# Altium project Boitier_Commande.PrjPcb
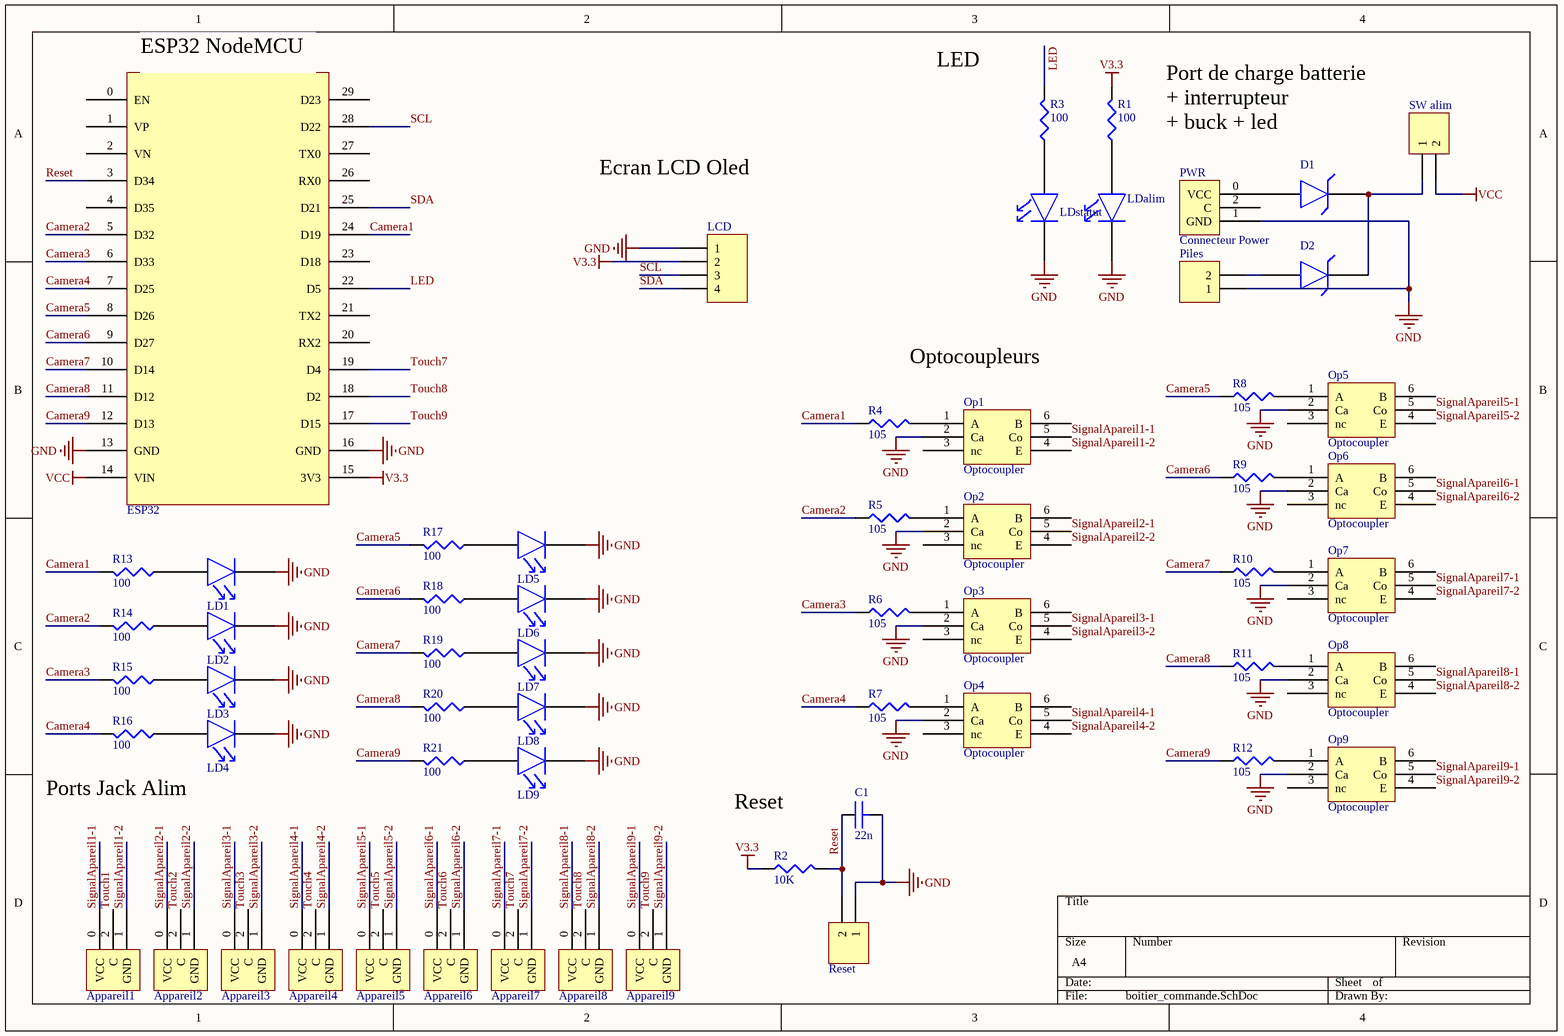
[diagram p0: boitier_commande.SchDoc]
1 sheet, 59 parts. Net scope: global (net labels, ports and power ports of the same name join across sheets).
Board file: boitier_commande.PcbDoc

## Sheet boitier_commande.SchDoc
size A4

### Parts
Appareil1  Connecteur Power  [Connecteur Power]  (value not drawn)
Appareil2  Connecteur Power  [Connecteur Power]  (value not drawn)
Appareil3  Connecteur Power  [Connecteur Power]  (value not drawn)
Appareil4  Connecteur Power  [Connecteur Power]  (value not drawn)
Appareil5  Connecteur Power  [Connecteur Power]  (value not drawn)
Appareil6  Connecteur Power  [Connecteur Power]  (value not drawn)
Appareil7  Connecteur Power  [Connecteur Power]  (value not drawn)
Appareil8  Connecteur Power  [Connecteur Power]  (value not drawn)
Appareil9  Connecteur Power  [Connecteur Power]  (value not drawn)
C1  value 22n  [RAD0.1]  (hidden comment: CAP)
D1  comment  [DIODE0.4]  (value not drawn)
D2  comment  [DIODE0.4]  (value not drawn)
ESP32  ESP32devKit  [ESP32]  (value not drawn)
LCD  OLED LCD  [HDR1X4]  (value not drawn)
LD1  comment  [LED0805]  (value not drawn)
LD2  comment  [LED0805]  (value not drawn)
LD3  comment  [LED0805]  (value not drawn)
LD4  comment  [LED0805]  (value not drawn)
LD5  comment  [LED0805]  (value not drawn)
LD6  comment  [LED0805]  (value not drawn)
LD7  comment  [LED0805]  (value not drawn)
LD8  comment  [LED0805]  (value not drawn)
LD9  comment  [LED0805]  (value not drawn)
LDalim  comment  [LED3]  (value not drawn)
LDstatut  comment  [LED3]  (value not drawn)
Op1  Optocoupler  [4N26]
Op2  Optocoupler  [4N26]
Op3  Optocoupler  [4N26]
Op4  Optocoupler  [4N26]
Op5  Optocoupler  [4N26]
Op6  Optocoupler  [4N26]
Op7  Optocoupler  [4N26]
Op8  Optocoupler  [4N26]
Op9  Optocoupler  [4N26]
Piles  Header 2  [HDR1X2]  (value not drawn)
PWR  Connecteur Power  [Connecteur Power]
R1  value 100  [AXIAL0.4]  (hidden comment: RES)
R2  value 10K  [AXIAL0.4]  (hidden comment: RES)
R3  value 100  [AXIAL0.4]  (hidden comment: RES)
R4  value 105  [AXIAL0.4]  (hidden comment: RES)
R5  value 105  [AXIAL0.4]  (hidden comment: RES)
R6  value 105  [AXIAL0.4]  (hidden comment: RES)
R7  value 105  [AXIAL0.4]  (hidden comment: RES)
R8  value 105  [AXIAL0.4]  (hidden comment: RES)
R9  value 105  [AXIAL0.4]  (hidden comment: RES)
R10  value 105  [AXIAL0.4]  (hidden comment: RES)
R11  value 105  [AXIAL0.4]  (hidden comment: RES)
R12  value 105  [AXIAL0.4]  (hidden comment: RES)
R13  value 100  [0805]  (hidden comment: RES)
R14  value 100  [0805]  (hidden comment: RES)
R15  value 100  [0805]  (hidden comment: RES)
R16  value 100  [0805]  (hidden comment: RES)
R17  value 100  [0805]  (hidden comment: RES)
R18  value 100  [0805]  (hidden comment: RES)
R19  value 100  [0805]  (hidden comment: RES)
R20  value 100  [0805]  (hidden comment: RES)
R21  value 100  [0805]  (hidden comment: RES)
Reset  Header 2  [HDR1X2]  (value not drawn)
SW_alim  Header 2  [HDR1X2]  (value not drawn)

### Nets
GND: C1.2 ESP32.13(GND) ESP32.16(GND) LCD.1 LD1.K LD2.K LD3.K LD4.K LD5.K LD6.K LD7.K LD8.K LD9.K LDalim.K LDstatut.K Op1.2(Ca) Op2.2(Ca) Op3.2(Ca) Op4.2(Ca) Op5.2(Ca) Op6.2(Ca) Op7.2(Ca) Op8.2(Ca) Op9.2(Ca) Piles.1 PWR.1(GND) Reset.1
V3.3: ESP32.15(3V3) LCD.2 R1.2 R2.1
VCC: ESP32.14(VIN) SW_alim.2
Camera1: ESP32.24(D19) R4.1 R13.2
Camera2: ESP32.5(D32) R5.1 R14.2
Camera3: ESP32.6(D33) R6.1 R15.2
Camera4: ESP32.7(D25) R7.1 R16.2
Camera5: ESP32.8(D26) R8.1 R17.2
Camera6: ESP32.9(D27) R9.1 R18.2
Camera7: ESP32.10(D14) R10.1 R19.2
Camera8: ESP32.11(D12) R11.1 R20.2
Camera9: ESP32.12(D13) R12.1 R21.2
LED: ESP32.22(D5) R3.2
Reset: C1.1 ESP32.3(D34) R2.2 Reset.2
SCL: ESP32.28(D22) LCD.3
SDA: ESP32.25(D21) LCD.4
SignalApareil1-1: Appareil1.0(VCC) Op1.5(Co)
SignalApareil1-2: Appareil1.1(GND) Op1.4(E)
SignalApareil2-1: Appareil2.0(VCC) Op2.5(Co)
SignalApareil2-2: Appareil2.1(GND) Op2.4(E)
SignalApareil3-1: Appareil3.0(VCC) Op3.5(Co)
SignalApareil3-2: Appareil3.1(GND) Op3.4(E)
SignalApareil4-1: Appareil4.0(VCC) Op4.5(Co)
SignalApareil4-2: Appareil4.1(GND) Op4.4(E)
SignalApareil5-1: Appareil5.0(VCC) Op5.5(Co)
SignalApareil5-2: Appareil5.1(GND) Op5.4(E)
SignalApareil6-1: Appareil6.0(VCC) Op6.5(Co)
SignalApareil6-2: Appareil6.1(GND) Op6.4(E)
SignalApareil7-1: Appareil7.0(VCC) Op7.5(Co)
SignalApareil7-2: Appareil7.1(GND) Op7.4(E)
SignalApareil8-1: Appareil8.0(VCC) Op8.5(Co)
SignalApareil8-2: Appareil8.1(GND) Op8.4(E)
SignalApareil9-1: Appareil9.0(VCC) Op9.5(Co)
SignalApareil9-2: Appareil9.1(GND) Op9.4(E)
Touch1: Appareil1.2(C)
Touch2: Appareil2.2(C)
Touch3: Appareil3.2(C)
Touch4: Appareil4.2(C)
Touch5: Appareil5.2(C)
Touch6: Appareil6.2(C)
Touch7: Appareil7.2(C) ESP32.19(D4)
Touch8: Appareil8.2(C) ESP32.18(D2)
Touch9: Appareil9.2(C) ESP32.17(D15)
NetD1_1: D1.1 PWR.0(VCC)
NetD1_2: D1.2 D2.2 SW_alim.1
NetD2_1: D2.1 Piles.2
NetLD1_A: LD1.A R13.1
NetLD2_A: LD2.A R14.1
NetLD3_A: LD3.A R15.1
NetLD4_A: LD4.A R16.1
NetLD5_A: LD5.A R17.1
NetLD6_A: LD6.A R18.1
NetLD7_A: LD7.A R19.1
NetLD8_A: LD8.A R20.1
NetLD9_A: LD9.A R21.1
NetLDalim_A: LDalim.A R1.1
NetLDstatut_A: LDstatut.A R3.1
NetOp1_1: Op1.1(A) R4.2
NetOp2_1: Op2.1(A) R5.2
NetOp3_1: Op3.1(A) R6.2
NetOp4_1: Op4.1(A) R7.2
NetOp5_1: Op5.1(A) R8.2
NetOp6_1: Op6.1(A) R9.2
NetOp7_1: Op7.1(A) R10.2
NetOp8_1: Op8.1(A) R11.2
NetOp9_1: Op9.1(A) R12.2

Not connected (* = marked no-connect by the designer): ESP32 0(EN) 1(VP) 2(VN) 4(D35) 20(RX2) 21(TX2) 23(D18) 26(RX0) 27(TX0) 29(D23); Op1 3(nc) 6(B); Op2 3(nc) 6(B); Op3 3(nc) 6(B); Op4 3(nc) 6(B); Op5 3(nc) 6(B); Op6 3(nc) 6(B); Op7 3(nc) 6(B); Op8 3(nc) 6(B); Op9 3(nc) 6(B); PWR 2(C)

### Notes on the sheet
- (near ESP32) ESP32 NodeMCU
- LED
- Port de charge batterie + interrupteur
  + buck + led
- Ecran LCD Oled
- Optocoupleurs
- Ports Jack Alim
- (near C1) Reset

### Library data of the parts
C1 = CAP: capacité non polarisée
D1 D2 = DIODE_schottky: diode schottky standard
LCD = Header 4: Header, 4-Pin; LatestRevisionDate: 17-Jul-2002; LatestRevisionNote: Re-released for DXP Platform.; Publisher: Altium Limited
LD1-LD9 LDalim LDstatut = LED: LED 5mm/3mm/CMS
Piles Reset SW_alim = Header 2: Header, 2-Pin; LatestRevisionDate: 17-Jul-2002; LatestRevisionNote: Re-released for DXP Platform.; Publisher: Altium Limited
R1-R21 = RES: resistance